# EAGLE design IO TOP BOARD (EAGLE 9.6.2)
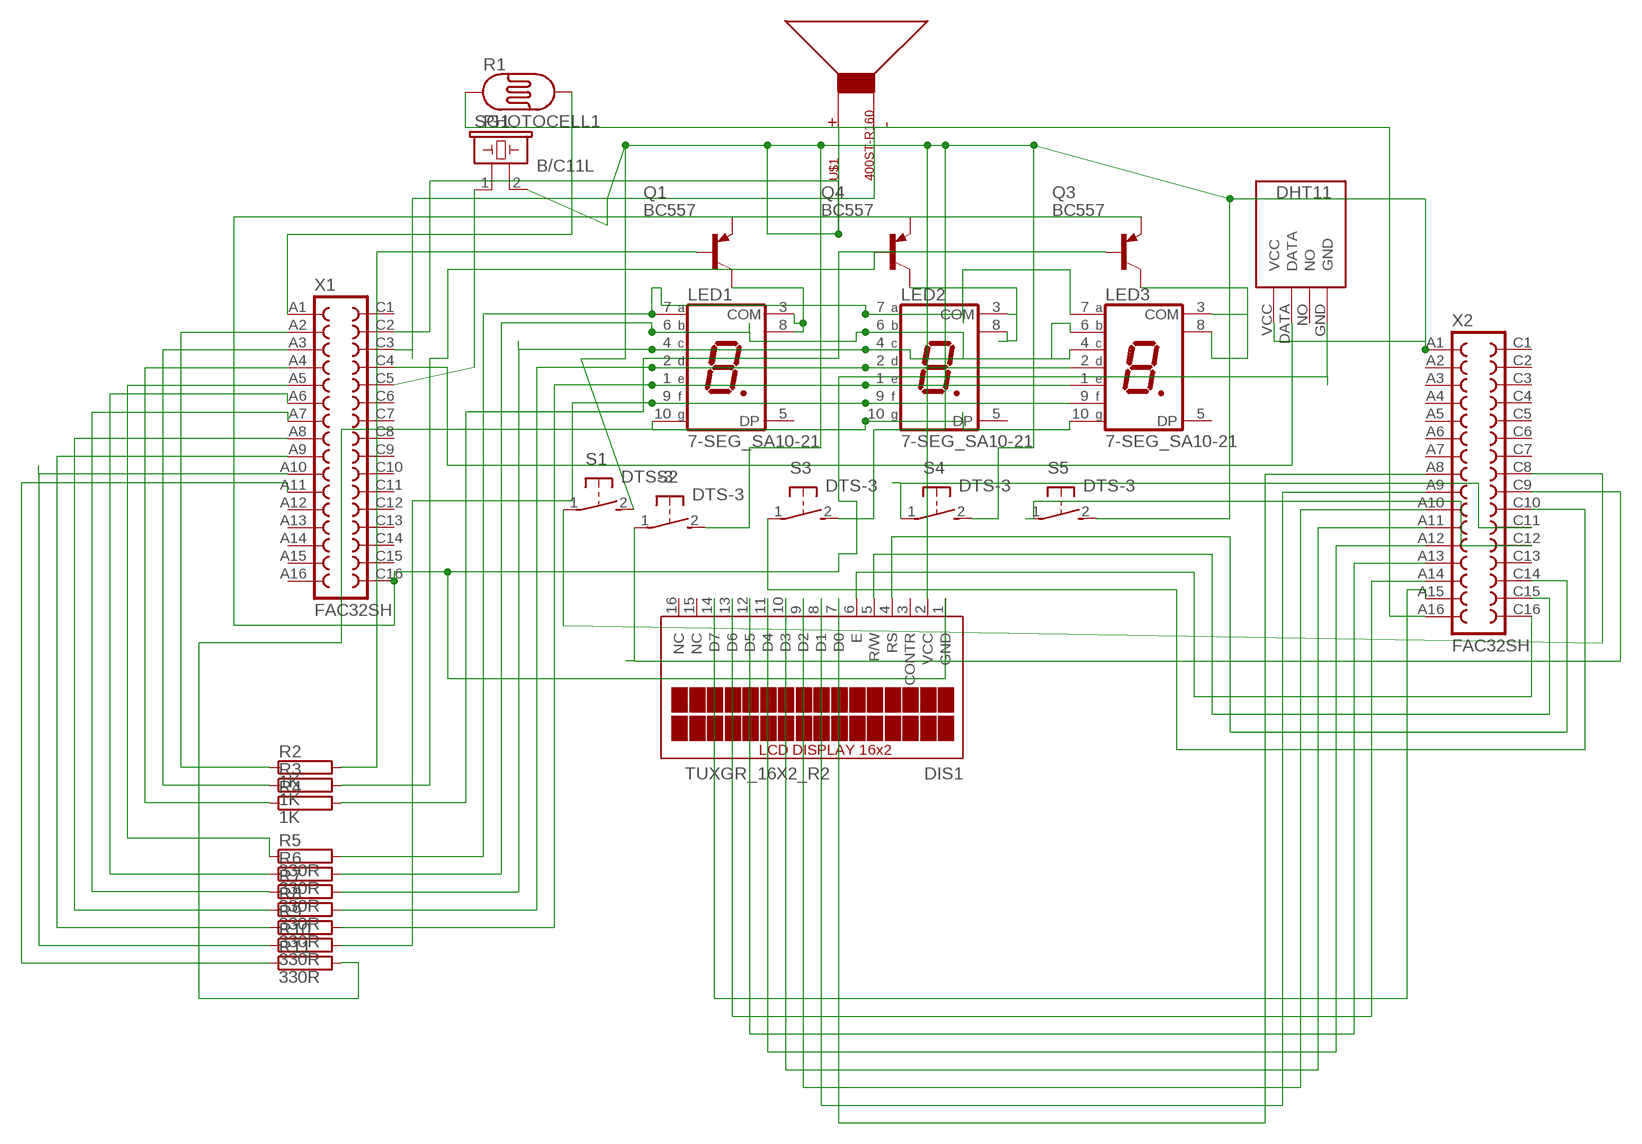
[diagram p0: schematic, sheet 1]

## Parts
DIS1  TUXGR_16X2_R2  [TUXGR_16X2_R2]
LED1  7-SEG_SA10-21  [SA10-21]
LED2  7-SEG_SA10-21  [SA10-21]
LED3  7-SEG_SA10-21  [SA10-21]
Q1  BC557  [TO92]
Q3  BC557  [TO92]
Q4  BC557  [TO92]
R1  PHOTOCELL1  [LDR_OFFBOARD]
R2  1K  RMG100-H  [TO-247-2H]
R3  1K  RMG100-H  [TO-247-2H]
R4  1K  RMG100-H  [TO-247-2H]
R5  330R  RMG100-H  [TO-247-2H]
R6  330R  RMG100-H  [TO-247-2H]
R7  330R  RMG100-H  [TO-247-2H]
R8  330R  RMG100-H  [TO-247-2H]
R9  330R  RMG100-H  [TO-247-2H]
R10  330R  RMG100-H  [TO-247-2H]
R11  330R  RMG100-H  [TO-247-2H]
S1  DTS-3  [DTS-3]
S2  DTS-3  [DTS-3]
S3  DTS-3  [DTS-3]
S4  DTS-3  [DTS-3]
S5  DTS-3  [DTS-3]
SG1  B/C11L  [B/C11L]
U$1  400ST-R160  [400STR160]
U$2  DHT11  [DHT11]
X1  FAC32SH  [FAC32SH]
X2  FAC32SH  [FAC32SH]

## Nets
N$1: LED1.3(COM) LED1.8(COM) Q1.3(C)
N$2: U$1.P$2 X1.C3
N$3: U$2.DATA X1.C4
N$4: SG1.1 X1.C5
N$5: DIS1.6(E) X2.C16
N$6: DIS1.5(R/W) X2.C15
N$7: DIS1.4(RS) X2.C14
N$8: R1.1 X2.A16
N$9: DIS1.7(D0) X2.A8
N$10: DIS1.8(D1) X2.A9
N$11: DIS1.9(D2) X2.A10
N$12: DIS1.10(D3) X2.A11
N$13: DIS1.11(D4) X2.A12
N$14: DIS1.12(D5) X2.A13
N$15: DIS1.13(D6) X2.A14
N$16: DIS1.14(D7) X2.A15
N$17: S1.1 X2.C8
N$18: S2.1 X2.C9
N$19: S3.1 X2.C10
N$20: S4.1 X2.C11
N$21: S5.1 X2.C12
N$22: DIS1.2(VCC) S1.2 S2.2 S3.2 S4.2 S5.2 SG1.2 U$1.P$1 U$2.VCC X1.C2 X2.A1
N$23: DIS1.1(GND) Q3.1(E) U$2.GND X1.C16
N$24: R1.2 X1.A1
N$25: LED2.3(COM) LED2.8(COM) Q4.3(C)
N$26: LED3.3(COM) LED3.8(COM) Q3.3(C)
N$27: Q1.2(B) R2.2
N$28: Q4.2(B) R3.2
N$29: Q3.2(B) R4.2
N$30: LED1.7(A) LED2.7(A) LED3.7(A) R5.2
N$31: LED1.6(B) LED2.6(B) LED3.6(B) R6.2
N$32: LED1.4(C) LED2.4(C) LED3.4(C) R7.2
N$33: LED1.2(D) LED2.2(D) LED3.2(D) R8.2
N$34: LED1.1(E) LED2.1(E) LED3.1(E) R9.2
N$35: LED1.9(F) LED2.9(F) LED3.9(F) R10.2
N$36: R5.1 X1.A5
N$37: R2.1 X1.A2
N$38: R3.1 X1.A3
N$39: R4.1 X1.A4
N$40: LED1.10(G) LED2.10(G) LED3.10(G) R11.2
N$41: R6.1 X1.A6
N$42: R7.1 X1.A7
N$43: R8.1 X1.A8
N$44: R9.1 X1.A9
N$45: R10.1 X1.A10
N$46: R11.1 X1.A11
Unconnected: DIS1.3(CONTR) DIS1.15(NC) DIS1.16(NC) LED1.5(DP) LED2.5(DP) LED3.5(DP) Q1.1(E) Q4.1(E) U$2.NO X1.A12 X1.A13 X1.A14 X1.A15 X1.A16 X1.C1 X1.C6 X1.C7 X1.C8 X1.C9 X1.C10 X1.C11 X1.C12 X1.C13 X1.C14 X1.C15 X2.A2 X2.A3 X2.A4 X2.A5 X2.A6 X2.A7 X2.C1 X2.C2 X2.C3 X2.C4 X2.C5 X2.C6 X2.C7 X2.C13

## Library data of the parts
DIS1 = display-lcd:TUXGR_16X2_R2: Tuxgraphics LCD display 16x2 characters reflective, without background light Source: tuxgr_12x2_r2.pdf; OC_FARNELL: unknown; OC_NEWARK: unknown
LED1-LED3 = display-kingbright:7-SEG_: Kingbright 14.2mm (0.56 INCH) SINGLE DIGIT NUMERIC DUISPLAY Source: SA56-11EWA(Ver1189471036.pdf; OC_FARNELL: unknown; OC_NEWARK: unknown
Q1 Q3 Q4 = transistor-pnp:BC557: PNP Transistor
R1 = LDR:PHOTOCELL: Photo Resitor
R2-R11 = resistor-power:RMG100: TO-247 Power Resistor - RMG 100 Series Source: www.token.com.tw .. power-resistor-rmg100pdf; OC_FARNELL: unknown; OC_NEWARK: unknown
S1-S5 = switch-tact:DTS-3
SG1 = buzzer:B/C11L: BUZZER Source: Buerklin; OC_FARNELL: unknown; OC_NEWARK: unknown
U$1 = ultrasonic_transducer-1:400ST-R160
U$2 = DHT11:DHT11: DHT11 Czujnik temperatury i wilgotności
X1 X2 = con-vg:FAC32SH: CONNECTOR female, 32 pins, block, type B, rows AC, grid 5.08 mm

## Board
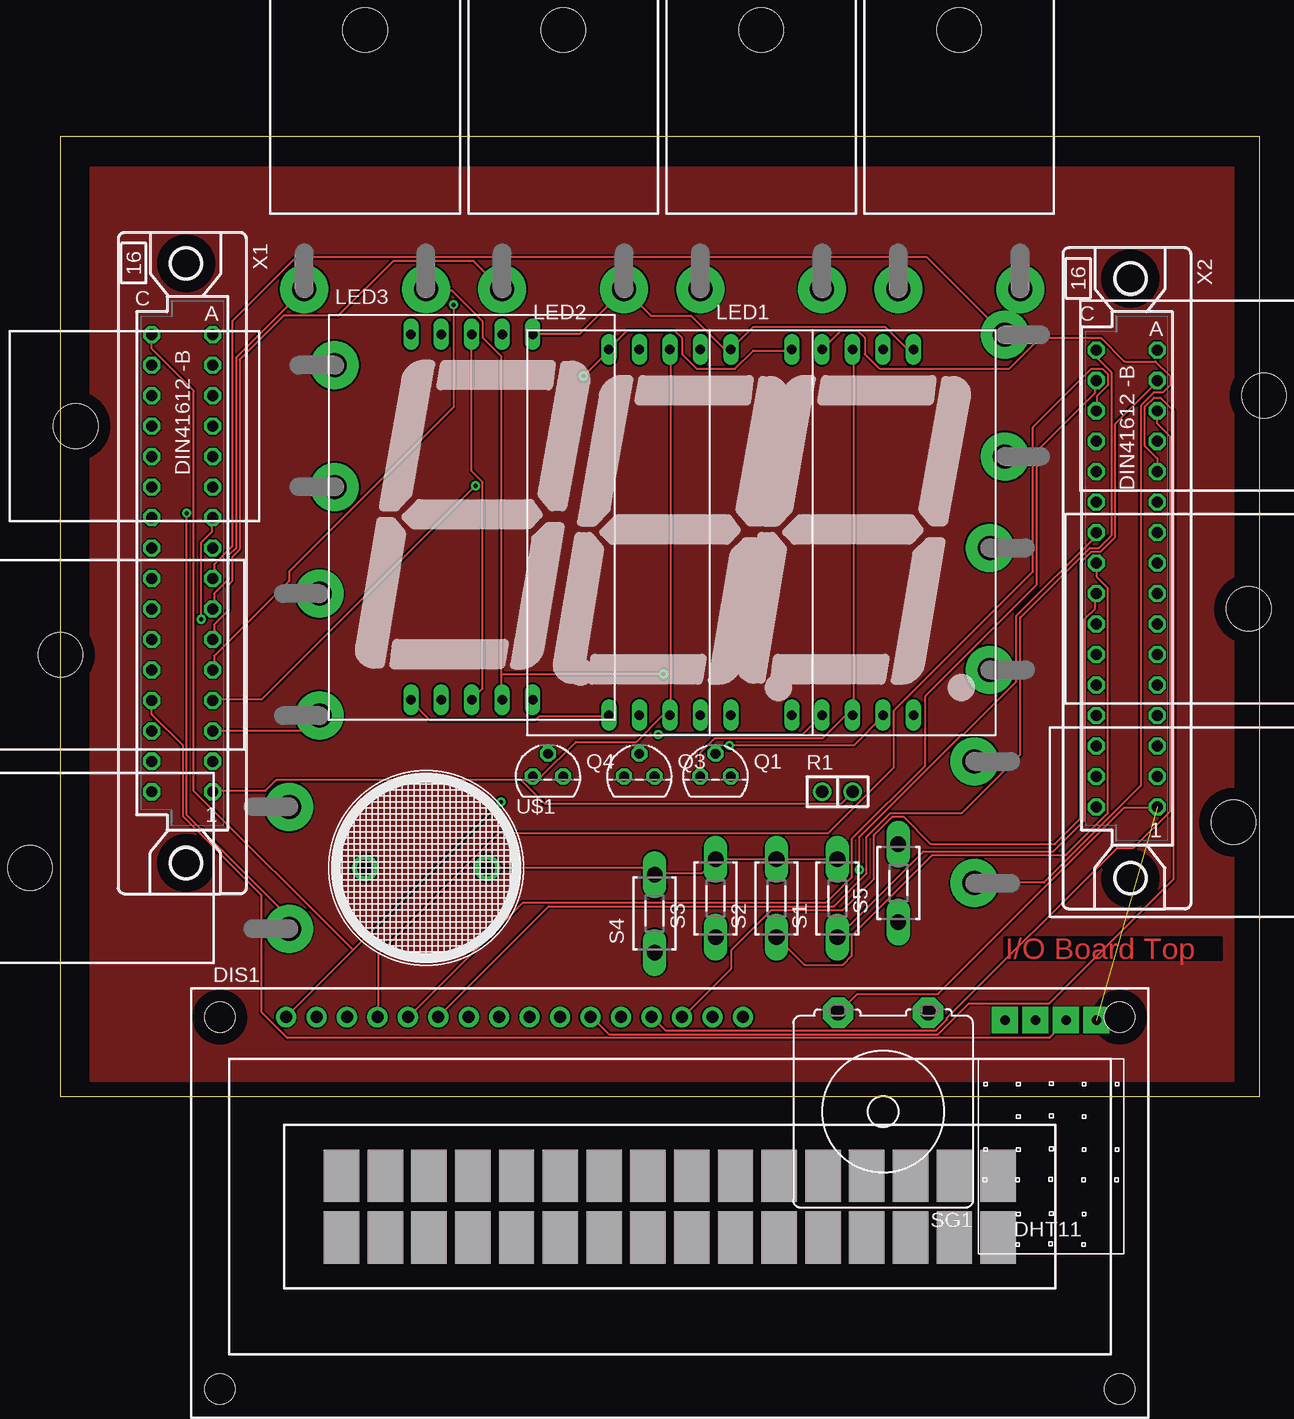
[diagram p1: board, top side]
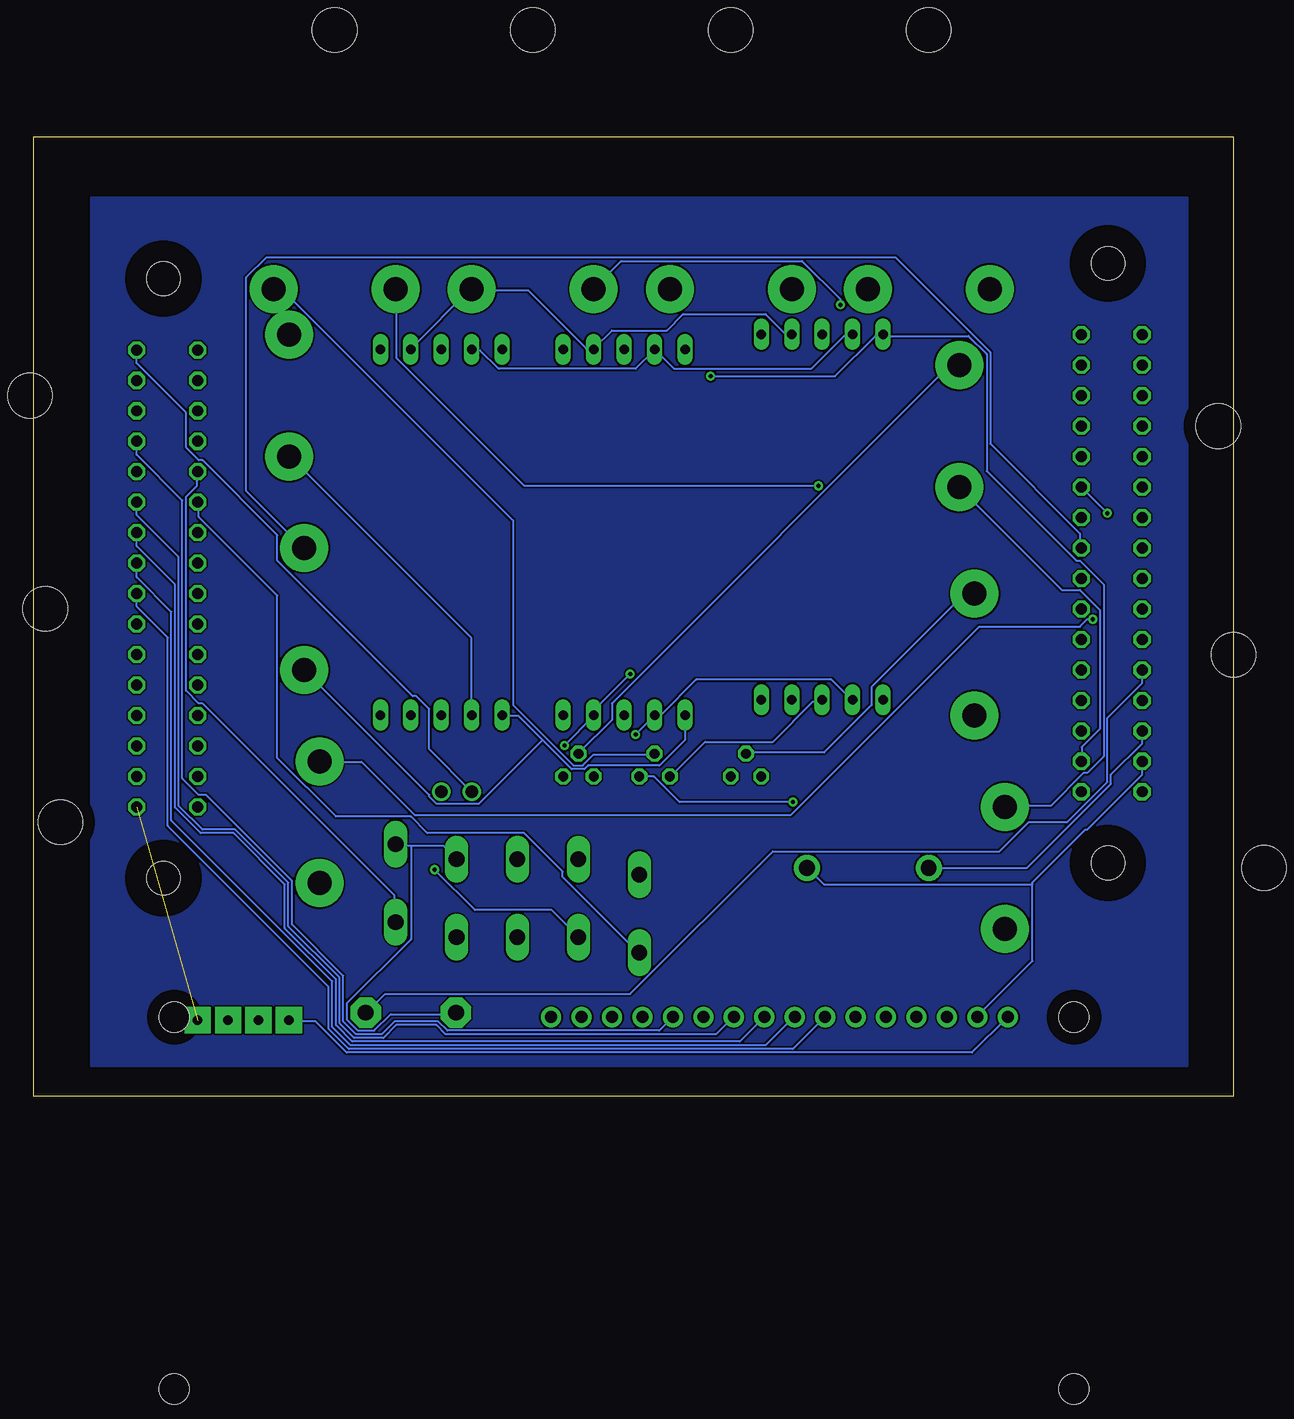
[diagram p2: board, bottom side, seen from below]

Size 100 x 80 mm. Coordinates in mm from the lower left corner, seen from the top.
Outline: 0,0 100,0 100,80 0,80 0,0
Copper layers (1*16): Top 0.035mm / dielectric 1.5mm / Bottom 0.035mm
Design rules "default": minimum track width 6mil, minimum drill 0.35mm, track to track 6mil, track to pad 6mil, pad to pad 6mil, via to via 6mil, smd to smd 6mil, copper to edge 40mil, drill to drill 6mil, minimum pad ring 10mil, minimum via ring 8mil, stop-mask expansion 4mil, vias tented up to drill 0mil, thermal gap 10mil

### Footprints (pad centres in the part's own frame; a part is rotated, then mirrored left to right if it is on the bottom)
TUXGR_16X2_R2 = drill 1 pad 1.676: 1 -32,15.5; 2 -29.46,15.5; 3 -26.92,15.5; 4 -24.38,15.5; 5 -21.84,15.5; 6 -19.3,15.5; 7 -16.76,15.5; 8 -14.22,15.5; 9 -11.68,15.5; 10 -9.14,15.5; 11 -6.6,15.5; 12 -4.06,15.5; 13 -1.52,15.5; 14 1.02,15.5; 15 3.56,15.5; 16 6.1,15.5 | hole 2.5: -37.5,-15.5; 37.5,-15.5; -37.5,15.5; 37.5,15.5
SA10-21 = drill 0.8 long: 1 -5.08,-15.2; 2 -2.54,-15.2; 3 0,-15.2; 4 2.54,-15.2; 5 5.08,-15.2; 6 5.08,15.28; 7 2.54,15.28; 8 0,15.28; 9 -2.54,15.28; 10 -5.08,15.28
TO92 = drill 0.813 octagon: 1 1.27,0; 2 0,1.905; 3 -1.27,0
LDR_OFFBOARD = drill 1.016: 1 -1.27,0; 2 1.27,0
TO-247-2H = drill 2 pad 4: 1 -5.08,-21.59; 2 5.08,-21.59 | hole 3.7: 0,0
DTS-3 = drill 1.3 long: 1 -3.25,0; 2 3.25,0
B/C11L = drill 1.321 pad 2.54 octagon: 1 -3.759,-8.255; 2 3.759,-8.255
400STR160 = drill 1.3 pad 2.184: P$1 5.08,0; P$2 -5.08,0
DHT11 = drill 0.8 pad 2.184 square: DATA -1.27,-11.43; GND 3.81,-11.43; NO 1.27,-11.43; VCC -3.81,-11.43
FAC32SH = drill 0.914 octagon: A1 -2.54,19.05; A2 -2.54,16.51; A3 -2.54,13.97; A4 -2.54,11.43; A5 -2.54,8.89; A6 -2.54,6.35; A7 -2.54,3.81; A8 -2.54,1.27; A9 -2.54,-1.27; A10 -2.54,-3.81; A11 -2.54,-6.35; A12 -2.54,-8.89; A13 -2.54,-11.43; A14 -2.54,-13.97; A15 -2.54,-16.51; A16 -2.54,-19.05; C1 2.54,19.05; C2 2.54,16.51; C3 2.54,13.97; C4 2.54,11.43; C5 2.54,8.89; C6 2.54,6.35; C7 2.54,3.81; C8 2.54,1.27; C9 2.54,-1.27; C10 2.54,-3.81; C11 2.54,-6.35; C12 2.54,-8.89; C13 2.54,-11.43; C14 2.54,-13.97; C15 2.54,-16.51; C16 2.54,-19.05 | hole 2.794: -0.305,24.994; -0.305,-24.994

### Placement (x,y rotation side)
DIS1  50.8,-8.89 0 top
LED1  66.04,46.99 0 top
LED2  50.8,46.99 0 top
LED3  34.29,48.26 0 top
Q1  54.61,26.67 0 top
Q3  48.26,26.67 0 top
Q4  40.64,26.67 0 top
R1  64.77,25.4 0 top
R2  1.27,55.88 90 top
R3  0,36.83 90 top
R4  74.93,88.9 0 top
R5  58.42,88.9 0 top
R6  41.91,88.9 0 top
R7  25.4,88.9 0 top
R8  100.33,58.42 270 top
R9  99.06,40.64 270 top
R10  97.79,22.86 270 top
R11  -2.54,19.05 90 top
S1  64.77,16.51 90 top
S2  59.69,16.51 90 top
S3  54.61,16.51 90 top
S4  49.53,15.24 90 top
S5  69.85,17.78 90 top
SG1  68.58,-1.27 180 top
U$1  30.48,19.05 0 top
U$2  82.55,-5.08 180 top
X1  10.16,44.45 180 top
X2  88.9,43.18 180 top

### Tracks (layer width: path | path; a pad name or v marks a point on that pad's centre or on a via)
GND
  pour Bottom: 3.81,74.93 95.25,74.93 95.25,73.66 95.25,3.81 95.25,2.54 5.08,2.54 3.81,2.54
  pour Top: 2.54,77.47 97.79,77.47 97.79,76.2 97.79,2.54 97.79,1.27 2.54,1.27
N$1
  Top 0.152: Q1.3 53.34,28.65 54.56,29.87 63.55,29.87 65.38,31.7 65.99,31.7 LED1.3 66.14,31.85 66.14,62.18 LED1.8
N$2
  Bottom 0.152: X1.C3 7.62,29.41 10.21,26.82 10.21,26.06 17.22,19.05 U$1.P$2
N$3
  Top 0.152: X1.C4 7.62,31.85 10.21,29.26 10.21,23.32 16.76,16.76 16.76,7.01 18.9,4.88 82.45,4.88 83.82,6.25 U$2.DATA
N$4
  Bottom 0.152: X1.C5 7.62,34.44 10.52,31.55 10.52,26.21 13.87,22.86 17.07,22.86 19.51,20.42 38.41,20.42 50.29,8.53 70.71,8.53 72.24,7.01 SG1.1
N$5
  Top 0.152: X2.C16 86.41,62.18 86.41,61.57 87.63,60.35 87.63,46.79 86.56,45.72 85.8,45.72 80.01,39.93 80.01,28.5 75.13,23.62 69.19,23.62 67.21,21.64 67.21,18.59 64.47,15.85 40.69,15.85 31.55,6.71 DIS1.6
N$6
  Top 0.152: X2.C15 86.26,59.59 86.26,58.67 81.38,53.8 81.38,42.67 72.08,33.38 72.08,27.58 65.99,21.49 65.99,18.29 63.86,16.15 38.56,16.15 29.11,6.71 DIS1.5
N$7
  Top 0.152: X2.C14 86.41,57.15 86.41,58.37 87.33,59.28 87.33,60.2 86.87,60.66 85.95,60.66 81.08,55.78 81.08,43.74 69.49,32.16 69.49,27.43 64.01,21.95 36.58,21.95 26.52,11.89 26.52,6.71 DIS1.4
N$8
  Bottom 0.152: X2.A16 91.44,61.11 87.33,57 87.33,54.1 86.26,53.03 85.95,53.03 79.7,46.79 79.7,44.65 68.43,33.38 68.12,33.38 67.06,32.31 67.06,28.96 R1.1
N$9
  Bottom 0.152: X2.A8 91.44,40.84 88.85,38.25 88.85,22.55 75.44,9.14 75.44,5.64 73.76,3.96 36.73,3.96 34.14,6.55 DIS1.7
N$10
  Bottom 0.152: X2.A9 91.44,43.28 88.54,40.39 88.54,23.01 75.13,9.6 75.13,5.79 73.61,4.27 39.01,4.27 36.73,6.55 DIS1.8
N$11
  Bottom 0.152: X2.A10 91.44,45.87 88.24,42.67 88.24,24.08 86.11,21.95 83.36,21.95 79.1,17.68 79.1,14.02 74.83,9.75 74.83,5.94 73.46,4.57 41.15,4.57 39.17,6.55 DIS1.9
N$12
  Bottom 0.152: X2.A11 91.44,48.46 87.94,44.96 87.94,24.23 85.95,22.25 83.21,22.25 78.79,17.83 78.79,14.17 74.52,9.91 74.52,6.1 73.3,4.88 70.87,4.88 69.8,5.94 66.45,5.94 65.68,5.18 43.13,5.18 41.76,6.55 DIS1.10
N$13
  Top 0.152: X2.A12 91.44,53.19 90.37,54.25 90.37,57.45 91.14,58.22 91.75,58.22 92.81,57.15 92.81,18.14 82.45,7.77 75.74,7.77 73.15,5.18 45.72,5.18 44.35,6.55 DIS1.11
N$14
  Bottom 0.152: X2.A13 91.44,53.49 87.63,49.68 87.63,26.52 86.26,25.15 85.65,25.15 78.49,17.98 78.49,14.33 74.22,10.06 74.22,6.25 73.15,5.18 71.02,5.18 69.95,6.25 66.29,6.25 65.53,5.49 47.85,5.49 46.79,6.55 DIS1.12
N$15
  Top 0.152: X2.A14 91.44,56.08 92.51,55.02 92.51,23.77 89.46,20.73 88.09,20.73 73.91,6.55 73.91,6.4 73,5.49 50.44,5.49 49.38,6.55 DIS1.13
N$16
  Top 0.152: X2.A15 91.44,59.59 87.94,56.08 87.94,46.63 86.72,45.41 85.95,45.41 85.04,44.5 85.04,23.16 82.91,21.03 72.54,21.03 70.26,23.32 69.34,23.32 67.82,21.79 67.82,18.14 65.23,15.54 59.28,15.54 55.93,12.19 55.93,10.67 51.97,6.71 DIS1.14
N$17
  Top 0.152: X2.C8 86.26,41.91 86.26,40.69 85.34,39.78 85.34,23.01 82.75,20.42 71.93,20.42 S1.1
N$18
  Top 0.152: X2.C9 86.41,44.35 86.41,43.28 87.33,42.37 87.33,23.62 83.82,20.12 72.69,20.12 65.99,13.41 65.99,11.73 65.23,10.97 62.03,10.97 59.74,13.26 S2.1
N$19  (via drill 0.35)
  Top 0.152: v66.6,18.9 66.6,21.64 75.13,30.18 75.29,30.18 79.7,34.59 79.7,40.08 86.26,46.63 86.26,46.94 X2.C10
  Bottom 0.152: v66.6,18.9 63.25,15.54 56.84,15.54 54.71,13.41 S3.1
N$20
  Bottom 0.152: X2.C11 86.26,49.53 86.26,48.31 79.7,41.76 79.7,28.19 74.83,23.32 68.58,23.32 67.21,21.95 59.13,21.95 55.93,18.75 55.93,18.29 49.53,11.89 S4.1
N$21
  Bottom 0.152: X2.C12 86.41,51.97 86.41,50.9 87.33,49.99 87.33,33.83 86.26,32.77 85.95,32.77 69.95,16.76 69.95,14.63 S5.1
N$22  (1 unrouted)
  Top 0.152: X2.A1 91.44,24.08 88.7,24.08 73.15,8.53 66.45,8.53 64.92,7.01 SG1.2 | 49.53,18.59 53.49,18.59 54.56,19.66 S3.2 54.71,19.81 59.59,19.81 S2.2 59.74,19.81 64.77,19.81 S1.2 | U$1.P$1 49.07,19.05 49.53,18.59 | 49.53,18.59 S4.2
  Bottom 0.152: X1.C2 7.62,26.82 12.19,22.25 12.34,22.25 16.76,17.83 16.76,17.68 | 16.76,17.68 16.76,11.28 21.34,6.71 DIS1.2 | 68.58,20.88 65.84,20.88 64.77,19.81 S1.2 | 68.58,20.88 69.8,20.88 S5.2 | 16.76,17.68 34.14,17.68 35.51,19.05 U$1.P$1 | 68.58,20.88 68.58,13.11 73.91,7.77 73.91,6.4 73,5.49 71.63,5.49 70.26,6.86 64.92,6.86 SG1.2
N$23  (via drill 0.35)
  Top 0.152: 24.38,12.19 18.9,6.71 DIS1.1 | 24.38,12.19 v36.73,24.54 | X1.C16 7.62,62.33 11.12,58.83 11.12,25.45 24.38,12.19
  Bottom 0.152: Q3.1 48.31,26.67 46.18,24.54 v36.73,24.54 | U$2.GND 78.64,6.25 76.5,6.25 73.91,3.66 21.79,3.66 18.9,6.55 DIS1.1
N$24
  Top 0.152: X1.A1 12.8,25.45 17.07,25.45 17.98,26.36 38.41,26.36 40.39,24.38 65.08,24.38 65.99,25.3 R1.2
N$25
  Top 0.152: Q4.3 40.08,26.67 42.98,29.57 48.01,29.57 50.14,31.7 50.75,31.7 LED2.3 50.9,31.85 50.9,62.18 LED2.8
N$26
  Top 0.152: LED3.8 34.29,52.12 35.2,51.21 35.2,33.98 LED3.3
  Bottom 0.152: LED3.3 34.29,32.92 35.05,32.92 38.41,29.57 44.04,29.57 46.94,26.67 Q3.3
N$27
  Bottom 0.152: R2.2 23.62,60.96 51.82,32.77 51.82,31.39 54.56,28.65 Q1.2
N$28
  Bottom 0.152: R3.2 22.4,41.91 30.18,34.14 30.18,32.61 34.14,28.65 40.54,28.65 Q4.2
N$29
  Bottom 0.152: Q3.2 48.31,28.5 53.34,28.5 54.25,27.58 55.02,27.58 60.05,32.61 60.05,48.01 79.25,67.21 80.01,67.21 R4.2
N$30
  Bottom 0.152: 53.34,62.33 53.95,62.33 58.83,67.21 63.4,67.21 R5.2 63.55,67.36 68.58,62.33 LED1.7 | 53.34,62.33 51.82,63.86 47.24,63.86 45.87,65.23 39.01,65.23 37.34,63.55 36.88,63.55 LED3.7 | 53.34,62.33 LED2.7
N$31
  Top 0.152: LED1.6 71.02,62.33 70.56,62.33 68.73,64.16 57.76,64.16 55.93,62.33 LED2.6 55.78,62.33 55.32,62.33 52.58,65.08 49.23,65.08 R6.2 46.94,67.21 43.28,63.55 39.47,63.55 LED3.6
N$32  (via drill 0.35)
  Top 0.152: v55.78,29.26 66.14,29.26 68.58,31.7 LED1.4 | 36.73,35.2 36.73,61.72 35.2,63.25 35.2,64.62 32.61,67.21 30.48,67.21 R7.2 | 36.73,35.2 36.73,33.07 LED3.4 | 36.73,35.2 v50.29,35.2
  Bottom 0.152: v55.78,29.26 53.34,31.7 LED2.4 53.34,32.16 v50.29,35.2
N$33  (via drill 0.35)
  Top 0.152: v49.84,30.18 61.87,30.18 63.4,31.7 LED1.2
  Bottom 0.152: LED3.2 31.85,33.07 33.53,34.75 44.81,34.75 47.7,31.85 48.16,31.85 LED2.2 48.31,31.7 v49.84,30.18 | LED1.2 63.55,31.85 63.55,38.25 78.64,53.34 R8.2
N$34
  Top 0.152: LED2.1 45.72,31.7 39.93,31.7 39.62,31.39 30.79,31.39 29.26,32.92 LED3.1
  Bottom 0.152: 57.61,29.72 55.17,27.28 54.1,27.28 53.8,27.58 47.85,27.58 45.72,29.72 LED2.1 | 57.61,29.72 59.59,31.7 60.96,31.7 LED1.1 | R9.2 67.06,25.15 67.06,24.99 66.45,24.38 62.94,24.38 57.61,29.72
N$35
  Top 0.152: R10.2 76.2,17.83 81.99,17.83 90.07,25.91 90.07,57.61 91.14,58.67 91.9,58.67 92.51,59.28 92.51,60.05 91.29,61.27 88.7,61.27 86.72,63.25 81.69,63.25 79.1,60.66 68.28,60.66 67.06,61.87 67.06,63.25 66.45,63.86 65.08,63.86 63.55,62.33 LED1.9
  Bottom 0.152: LED3.9 31.85,63.4 32.46,63.4 35.2,60.66 46.63,60.66 48.16,62.18 LED2.9 48.31,62.18 49.84,60.66 61.27,60.66 62.79,62.18 63.4,62.18 LED1.9
N$36  (via drill 0.35)
  Top 0.152: v32.77,65.99 32.77,57.45 19.05,43.74 19.05,42.98 12.8,36.73 12.8,35.66 X1.A5
  Bottom 0.152: v32.77,65.99 32.77,66.45 35.97,69.65 51.05,69.65 53.34,67.36 R5.1
N$37
  Bottom 0.152: X1.A2 12.65,28.04 12.65,29.11 11.12,30.63 11.12,40.54 12.8,42.22 14.33,42.22 22.86,50.75 R2.1
N$38
  Top 0.152: X1.A3 20.27,30.48 21.49,31.7 R3.1
N$39  (via drill 0.35)
  Top 0.152: v34.59,50.9 16.76,33.07 12.8,33.07 X1.A4
  Bottom 0.152: v34.59,50.9 59.13,50.9 69.8,61.57 69.8,67.21 R4.1
N$40  (via drill 0.35)
  Top 0.152: v43.59,60.05 45.72,62.18 LED2.10 45.72,62.33 47.24,63.86 51.21,63.86 51.82,63.25 51.82,61.87 53.03,60.66 56.24,60.66 57.76,62.18 60.96,62.18 LED1.10
  Bottom 0.152: v43.59,60.05 33.22,60.05 29.87,63.4 29.26,63.4 LED3.10 29.11,63.4 22.1,63.4 20.57,61.87 20.57,52.12 13.11,44.65 12.8,44.65 10.82,42.67 10.82,28.35 12.19,26.98 12.5,26.98 15.24,24.23 19.05,24.23 R11.2
N$41
  Top 0.152: X1.A6 12.8,38.1 12.8,39.32 14.02,40.54 14.02,42.67 14.33,42.98 14.33,44.96 14.94,45.57 14.94,61.42 18.59,65.08 23.16,65.08 27.74,69.65 34.44,69.65 36.73,67.36 R6.1
N$42
  Top 0.152: X1.A7 12.8,40.69 12.8,41.91 14.02,43.13 14.02,45.11 14.63,45.72 14.63,61.57 20.27,67.21 R7.1
N$43
  Top 0.152: X1.A8 12.8,43.28 12.8,44.35 14.33,45.87 14.33,64.62 19.66,69.95 72.24,69.95 78.64,63.55 R8.1
N$44
  Bottom 0.152: X1.A9 12.8,45.72 12.8,46.94 20.27,54.41 20.27,62.03 28.19,69.95 80.62,69.95 82.3,68.28 82.3,50.44 77.57,45.72 R9.1
N$45  (via drill 0.35)
  Top 0.152: v11.73,39.78 11.73,46.18 12.65,47.09 12.65,48.16 X1.A10
  Bottom 0.152: v11.73,39.78 12.19,39.78 12.8,39.17 21.18,39.17 36.88,23.47 68.28,23.47 72.69,27.89 76.2,27.89 R10.1
N$46  (via drill 0.35)
  Top 0.152: v10.52,48.62 10.52,23.47 19.05,14.94 R11.1
  Bottom 0.152: v10.52,48.62 X1.A11

### Text on the board
Top: I/O Board Top